# Altium schematic sheet Boost Drive.SchDoc
size A4; SheetNumber: 1; SheetTotal: 1
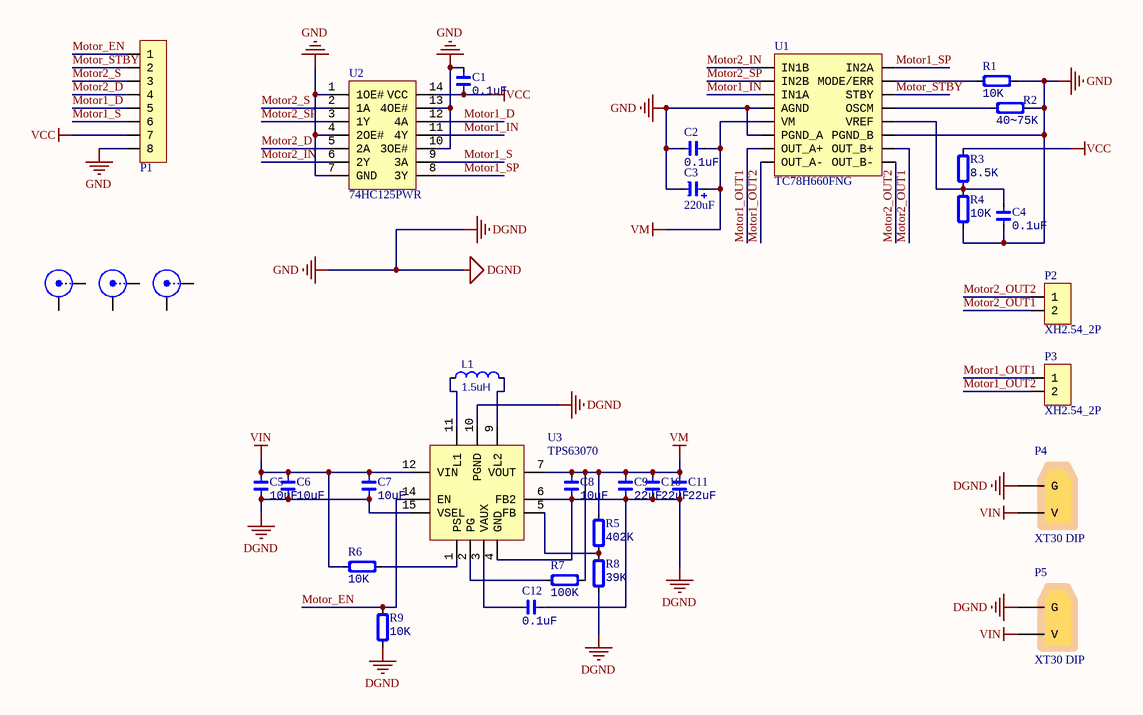
[diagram p0: Boost Drive.SchDoc]

## Parts
C1  0.1uF  [0603_CAP]
C2  0.1uF  [0603_CAP]
C3  220uF  [CAP-TH_BD8.0-P3.50-D1.0-FD]
C4  0.1uF  [0603_CAP]
C5  10uF  [0805_CAP]
C6  10uF  [0805_CAP]
C7  10uF  [0603_CAP]
C8  10uF  [0603_CAP]
C9  22uF  [0805_CAP]
C10  22uF  [0805_CAP]
C11  22uF  [0805_CAP]
C12  0.1uF  [0805_CAP]
Hole1  Hole  [Hole]  (value not drawn)
Hole2  Hole  [Hole]  (value not drawn)
Hole3  Hole  [Hole]  (value not drawn)
L1  1.5uH  [CDRH74R]
P1  HDR1x8_2.54_F  [HDR_1X8_F]  (value not drawn)
P2  XH2.54_2P  [XH2.54_2P]
P3  XH2.54_2P  [XH2.54_2P]
P4  XT30 DIP  [XT30 DIP]
P5  XT30 DIP  [XT30 DIP]
R1  10K  [0805_RES]
R2  40~75K  [0805_RES]
R3  8.5K  [0805_RES]
R4  10K  [0805_RES]
R5  402K  [0805_RES]
R6  10K  [0805_RES]
R7  100K  [0805_RES]
R8  39K  [0805_RES]
R9  10K  [0805_RES]
U1  TC78H660FNG  [TSSOP-16_L5.0-W4.4-P0.65-LS6.4-BL]
U2  74HC125PWR  [TSSOP-14_L5.0-W4.4-P0.65-LS6.5-BL]
U3  TPS63070  [VQFN-15_L3.0-W2.5-P0.50-BL]

## Nets
DGND: C1.2 C2.1 C3.2 C4.1 C5.1 C6.1 C7.1 C8.1 C9.1 C10.1 C11.1 C12.1 P1.8 P4.2(G) P5.2(G) R1.1 R2.1 R4.1 R8.1 R9.1 U1.4(AGND) U1.6(PGND_A) U1.11(PGND_B) U2.1(1OE#) U2.4(2OE#) U2.7(GND) U2.10(3OE#) U2.13(4OE#) U3.4(GND) U3.6(FB2) U3.10(PGND) U3.15(VSEL)  [also labelled GND]
VCC: C1.1 P1.7 R3.2 U2.14(VCC)
VIN: C5.2 C6.2 C7.2 P4.1(V) P5.1(V) R6.1 U3.12(VIN)
VM: C2.2 C3.1 C8.2 C9.2 C10.2 C11.2 R5.2 R7.2 U1.5(VM) U3.7(VOUT)
Motor1_D: P1.5 U2.12(4A)
Motor1_IN: U1.3(IN1A) U2.11(4Y)
Motor1_OUT1: P3.1 U1.7(OUT_A+)
Motor1_OUT2: P3.2 U1.8(OUT_A-)
Motor1_S: P1.6 U2.9(3A)
Motor1_SP: U1.16(IN2A) U2.8(3Y)
Motor2_D: P1.4 U2.5(2A)
Motor2_IN: U1.1(IN1B) U2.6(2Y)
Motor2_OUT1: P2.2 U1.10(OUT_B+)
Motor2_OUT2: P2.1 U1.9(OUT_B-)
Motor2_S: P1.3 U2.2(1A)
Motor2_SP: U1.2(IN2B) U2.3(1Y)
Motor_EN: P1.1 R9.2 U3.14(EN)
Motor_STBY: P1.2 U1.14(STBY)
NetC4_2: C4.2 R3.1 R4.2 U1.12(VREF)
NetC12_2: C12.2 U3.3(VAUX)
NetL1_1: L1.1 U3.11(L1)
NetL1_2: L1.2 U3.9(L2)
NetR1_2: R1.2 U1.15(MODE/ERR)
NetR2_2: R2.2 U1.13(OSCM)
NetR5_1: R5.1 R8.2 U3.5(FB)
NetR6_2: R6.2 U3.1(PS)
NetR7_1: R7.1 U3.2(PG)

Not connected (* = marked no-connect by the designer): Hole1 1(X) 2(Y); Hole2 1(X) 2(Y); Hole3 1(X) 2(Y)

## Library data of the parts
C1 C2 C4 C7 C8 = 0603_CAP: Capacitor; Specification: X7R 50V; Manufacturer: *
C3 = CAP_8x11.5: Electrolytic capacitor
C5 C6 C9-C12 = 0805_CAP: Capacitor; Specification: X7R 50V; Manufacturer: *
L1 = IND: Inductor; BOM_Manufacturer: microgate; BOM_Manufacturer Part: MPIT6045-330M-LF; nameAlias: Inductance; Contributor: LCSC; BOM_Supplier: LCSC; BOM_Supplier Part: C696490; spicePre: L; spiceSymbolName: MPIT6045-330M-LF
P1 = HDR1x8_2.54_F: Header
P4 P5 = XT30 DIP: XT30 板载直头直插
R1-R9 = 0805_RES: Resistor; Specification: ±5%; Manufacturer: *